# EAGLE design display (EAGLE 9.2.0)
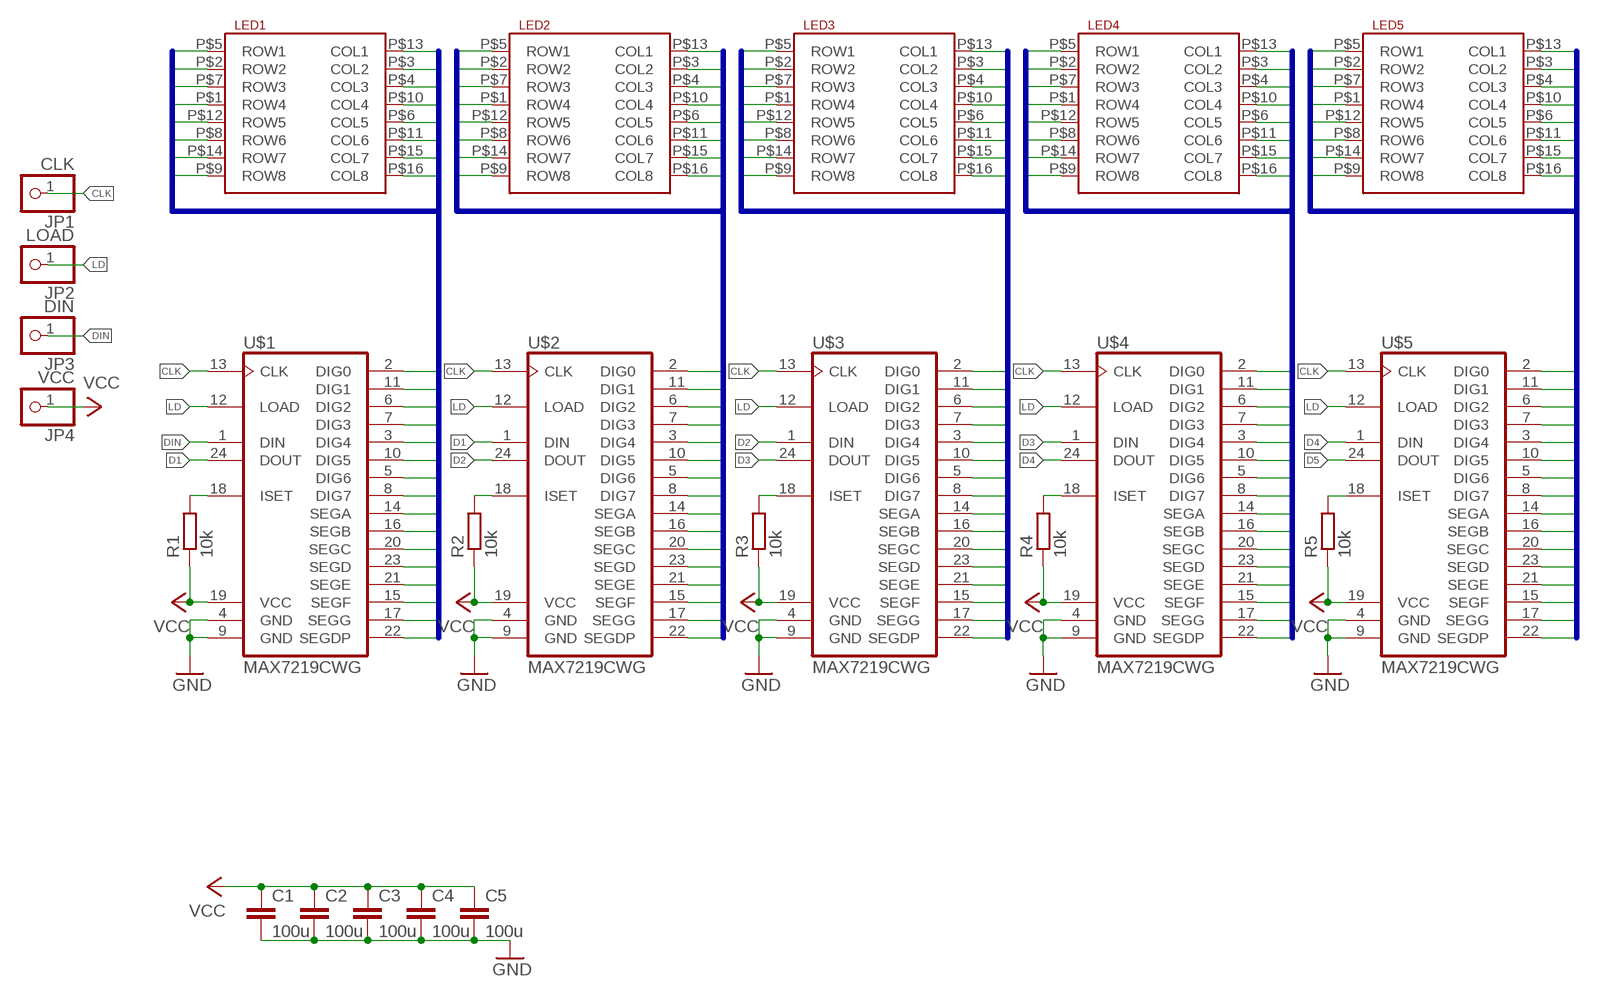
[diagram p0: schematic, sheet 1]

## Parts
C1  100u  C-EUC0805  [C0805]
C2  100u  C-EUC0805  [C0805]
C3  100u  C-EUC0805  [C0805]
C4  100u  C-EUC0805  [C0805]
C5  100u  C-EUC0805  [C0805]
JP1  CLK  PINHD-1X1  [1X01]
JP2  LOAD  PINHD-1X1  [1X01]
JP3  DIN  PINHD-1X1  [1X01]
JP4  VCC  PINHD-1X1  [1X01]
LED1  LED_8X8_MATRIX07088BH  [MATRIX_8X8_20MM]
LED2  LED_8X8_MATRIX07088BH  [MATRIX_8X8_20MM]
LED3  LED_8X8_MATRIX07088BH  [MATRIX_8X8_20MM]
LED4  LED_8X8_MATRIX07088BH  [MATRIX_8X8_20MM]
LED5  LED_8X8_MATRIX07088BH  [MATRIX_8X8_20MM]
R1  10k  R-EU_R0805  [R0805]
R2  10k  R-EU_R0805  [R0805]
R3  10k  R-EU_R0805  [R0805]
R4  10k  R-EU_R0805  [R0805]
R5  10k  R-EU_R0805  [R0805]
U$1  MAX7219CWG  [SO24L]
U$2  MAX7219CWG  [SO24L]
U$3  MAX7219CWG  [SO24L]
U$4  MAX7219CWG  [SO24L]
U$5  MAX7219CWG  [SO24L]

## Nets
CLK: JP1.1 U$1.13(CLK) U$2.13(CLK) U$3.13(CLK) U$4.13(CLK) U$5.13(CLK)
D1: U$1.24(DOUT) U$2.1(DIN)
D2: U$2.24(DOUT) U$3.1(DIN)
D3: U$3.24(DOUT) U$4.1(DIN)
D4: U$4.24(DOUT) U$5.1(DIN)
D5: U$5.24(DOUT)
DIN: JP3.1 U$1.1(DIN)
GND [GND]: C1.2 C2.2 C3.2 C4.2 C5.2 U$1.4(GND) U$1.9(GND) U$2.4(GND) U$2.9(GND) U$3.4(GND) U$3.9(GND) U$4.4(GND) U$4.9(GND) U$5.4(GND) U$5.9(GND)
LD: JP2.1 U$1.12(LOAD) U$2.12(LOAD) U$3.12(LOAD) U$4.12(LOAD) U$5.12(LOAD)
MATRIX1_ANODE1: LED1.P$5(ROW1) U$1.14(SEGA)
MATRIX1_ANODE2: LED1.P$2(ROW2) U$1.16(SEGB)
MATRIX1_ANODE3: LED1.P$7(ROW3) U$1.20(SEGC)
MATRIX1_ANODE4: LED1.P$1(ROW4) U$1.23(SEGD)
MATRIX1_ANODE5: LED1.P$12(ROW5) U$1.21(SEGE)
MATRIX1_ANODE6: LED1.P$8(ROW6) U$1.15(SEGF)
MATRIX1_ANODE7: LED1.P$14(ROW7) U$1.17(SEGG)
MATRIX1_ANODE8: LED1.P$9(ROW8) U$1.22(SEGDP)
MATRIX1_CATHODE1: LED1.P$13(COL1) U$1.2(DIG0)
MATRIX1_CATHODE2: LED1.P$3(COL2) U$1.11(DIG1)
MATRIX1_CATHODE3: LED1.P$4(COL3) U$1.6(DIG2)
MATRIX1_CATHODE4: LED1.P$10(COL4) U$1.7(DIG3)
MATRIX1_CATHODE5: LED1.P$6(COL5) U$1.3(DIG4)
MATRIX1_CATHODE6: LED1.P$11(COL6) U$1.10(DIG5)
MATRIX1_CATHODE7: LED1.P$15(COL7) U$1.5(DIG6)
MATRIX1_CATHODE8: LED1.P$16(COL8) U$1.8(DIG7)
MATRIX2_ANODE1: LED2.P$5(ROW1) U$2.14(SEGA)
MATRIX2_ANODE2: LED2.P$2(ROW2) U$2.16(SEGB)
MATRIX2_ANODE3: LED2.P$7(ROW3) U$2.20(SEGC)
MATRIX2_ANODE4: LED2.P$1(ROW4) U$2.23(SEGD)
MATRIX2_ANODE5: LED2.P$12(ROW5) U$2.21(SEGE)
MATRIX2_ANODE6: LED2.P$8(ROW6) U$2.15(SEGF)
MATRIX2_ANODE7: LED2.P$14(ROW7) U$2.17(SEGG)
MATRIX2_ANODE8: LED2.P$9(ROW8) U$2.22(SEGDP)
MATRIX2_CATHODE1: LED2.P$13(COL1) U$2.2(DIG0)
MATRIX2_CATHODE2: LED2.P$3(COL2) U$2.11(DIG1)
MATRIX2_CATHODE3: LED2.P$4(COL3) U$2.6(DIG2)
MATRIX2_CATHODE4: LED2.P$10(COL4) U$2.7(DIG3)
MATRIX2_CATHODE5: LED2.P$6(COL5) U$2.3(DIG4)
MATRIX2_CATHODE6: LED2.P$11(COL6) U$2.10(DIG5)
MATRIX2_CATHODE7: LED2.P$15(COL7) U$2.5(DIG6)
MATRIX2_CATHODE8: LED2.P$16(COL8) U$2.8(DIG7)
MATRIX3_ANODE1: LED3.P$5(ROW1) U$3.14(SEGA)
MATRIX3_ANODE2: LED3.P$2(ROW2) U$3.16(SEGB)
MATRIX3_ANODE3: LED3.P$7(ROW3) U$3.20(SEGC)
MATRIX3_ANODE4: LED3.P$1(ROW4) U$3.23(SEGD)
MATRIX3_ANODE5: LED3.P$12(ROW5) U$3.21(SEGE)
MATRIX3_ANODE6: LED3.P$8(ROW6) U$3.15(SEGF)
MATRIX3_ANODE7: LED3.P$14(ROW7) U$3.17(SEGG)
MATRIX3_ANODE8: LED3.P$9(ROW8) U$3.22(SEGDP)
MATRIX3_CATHODE1: LED3.P$13(COL1) U$3.2(DIG0)
MATRIX3_CATHODE2: LED3.P$3(COL2) U$3.11(DIG1)
MATRIX3_CATHODE3: LED3.P$4(COL3) U$3.6(DIG2)
MATRIX3_CATHODE4: LED3.P$10(COL4) U$3.7(DIG3)
MATRIX3_CATHODE5: LED3.P$6(COL5) U$3.3(DIG4)
MATRIX3_CATHODE6: LED3.P$11(COL6) U$3.10(DIG5)
MATRIX3_CATHODE7: LED3.P$15(COL7) U$3.5(DIG6)
MATRIX3_CATHODE8: LED3.P$16(COL8) U$3.8(DIG7)
MATRIX4_ANODE1: LED4.P$5(ROW1) U$4.14(SEGA)
MATRIX4_ANODE2: LED4.P$2(ROW2) U$4.16(SEGB)
MATRIX4_ANODE3: LED4.P$7(ROW3) U$4.20(SEGC)
MATRIX4_ANODE4: LED4.P$1(ROW4) U$4.23(SEGD)
MATRIX4_ANODE5: LED4.P$12(ROW5) U$4.21(SEGE)
MATRIX4_ANODE6: LED4.P$8(ROW6) U$4.15(SEGF)
MATRIX4_ANODE7: LED4.P$14(ROW7) U$4.17(SEGG)
MATRIX4_ANODE8: LED4.P$9(ROW8) U$4.22(SEGDP)
MATRIX4_CATHODE1: LED4.P$13(COL1) U$4.2(DIG0)
MATRIX4_CATHODE2: LED4.P$3(COL2) U$4.11(DIG1)
MATRIX4_CATHODE3: LED4.P$4(COL3) U$4.6(DIG2)
MATRIX4_CATHODE4: LED4.P$10(COL4) U$4.7(DIG3)
MATRIX4_CATHODE5: LED4.P$6(COL5) U$4.3(DIG4)
MATRIX4_CATHODE6: LED4.P$11(COL6) U$4.10(DIG5)
MATRIX4_CATHODE7: LED4.P$15(COL7) U$4.5(DIG6)
MATRIX4_CATHODE8: LED4.P$16(COL8) U$4.8(DIG7)
MATRIX5_ANODE1: LED5.P$5(ROW1) U$5.14(SEGA)
MATRIX5_ANODE2: LED5.P$2(ROW2) U$5.16(SEGB)
MATRIX5_ANODE3: LED5.P$7(ROW3) U$5.20(SEGC)
MATRIX5_ANODE4: LED5.P$1(ROW4) U$5.23(SEGD)
MATRIX5_ANODE5: LED5.P$12(ROW5) U$5.21(SEGE)
MATRIX5_ANODE6: LED5.P$8(ROW6) U$5.15(SEGF)
MATRIX5_ANODE7: LED5.P$14(ROW7) U$5.17(SEGG)
MATRIX5_ANODE8: LED5.P$9(ROW8) U$5.22(SEGDP)
MATRIX5_CATHODE1: LED5.P$13(COL1) U$5.2(DIG0)
MATRIX5_CATHODE2: LED5.P$3(COL2) U$5.11(DIG1)
MATRIX5_CATHODE3: LED5.P$4(COL3) U$5.6(DIG2)
MATRIX5_CATHODE4: LED5.P$10(COL4) U$5.7(DIG3)
MATRIX5_CATHODE5: LED5.P$6(COL5) U$5.3(DIG4)
MATRIX5_CATHODE6: LED5.P$11(COL6) U$5.10(DIG5)
MATRIX5_CATHODE7: LED5.P$15(COL7) U$5.5(DIG6)
MATRIX5_CATHODE8: LED5.P$16(COL8) U$5.8(DIG7)
N$1: R5.2 U$5.18(ISET)
N$5: R1.2 U$1.18(ISET)
N$10: R2.2 U$2.18(ISET)
N$15: R3.2 U$3.18(ISET)
N$20: R4.2 U$4.18(ISET)
VCC [VCC]: C1.1 C2.1 C3.1 C4.1 C5.1 JP4.1 R1.1 R2.1 R3.1 R4.1 R5.1 U$1.19(VCC) U$2.19(VCC) U$3.19(VCC) U$4.19(VCC) U$5.19(VCC)

## Buses
MATRIX1:MATRIX1_ANODE1,MATRIX1_ANODE2,MATRIX1_ANODE3,MATRIX1_ANODE4,MATRIX1_ANODE5,MATRIX1_ANODE6,MATRIX1_ANODE7,MATRIX1_ANODE8,MATRIX1_CATHODE1,MATRIX1_CATHODE2,MATRIX1_CATHODE3,MATRIX1_CATHODE4,MATRIX1_CATHODE5,MATRIX1_CATHODE6,MATRIX1_CATHODE7,MATRIX1_CATHODE8
MATRIX2:MATRIX2_ANODE1,MATRIX2_ANODE2,MATRIX2_ANODE3,MATRIX2_ANODE4,MATRIX2_ANODE5,MATRIX2_ANODE6,MATRIX2_ANODE7,MATRIX2_ANODE8,MATRIX2_CATHODE1,MATRIX2_CATHODE2,MATRIX2_CATHODE3,MATRIX2_CATHODE4,MATRIX2_CATHODE5,MATRIX2_CATHODE6,MATRIX2_CATHODE7,MATRIX2_CATHODE8
MATRIX3:MATRIX3_ANODE1,MATRIX3_ANODE2,MATRIX3_ANODE3,MATRIX3_ANODE4,MATRIX3_ANODE5,MATRIX3_ANODE6,MATRIX3_ANODE7,MATRIX3_ANODE8,MATRIX3_CATHODE1,MATRIX3_CATHODE2,MATRIX3_CATHODE3,MATRIX3_CATHODE4,MATRIX3_CATHODE5,MATRIX3_CATHODE6,MATRIX3_CATHODE7,MATRIX3_CATHODE8
MATRIX4:MATRIX4_ANODE1,MATRIX4_ANODE2,MATRIX4_ANODE3,MATRIX4_ANODE4,MATRIX4_ANODE5,MATRIX4_ANODE6,MATRIX4_ANODE7,MATRIX4_ANODE8,MATRIX4_CATHODE1,MATRIX4_CATHODE2,MATRIX4_CATHODE3,MATRIX4_CATHODE4,MATRIX4_CATHODE5,MATRIX4_CATHODE6,MATRIX4_CATHODE7,MATRIX4_CATHODE8
MATRIX5:MATRIX5_ANODE1,MATRIX5_ANODE2,MATRIX5_ANODE3,MATRIX5_ANODE4,MATRIX5_ANODE5,MATRIX5_ANODE6,MATRIX5_ANODE7,MATRIX5_ANODE8,MATRIX5_CATHODE1,MATRIX5_CATHODE2,MATRIX5_CATHODE3,MATRIX5_CATHODE4,MATRIX5_CATHODE5,MATRIX5_CATHODE6,MATRIX5_CATHODE7,MATRIX5_CATHODE8

## Library data of the parts
C1-C5 = rcl:C-EU: CAPACITOR, European symbol; SPICEPREFIX: C
JP1-JP4 = pinhead:PINHD-1X1: PIN HEADER
LED1-LED5 = LED:LED_8X8_MATRIX: CPD-15088A YGD2/A Green 8x8 LED matrix
R1-R5 = rcl:R-EU_: RESISTOR, European symbol; SPICEPREFIX: R
U$1-U$5 = max7219:MAX7219CWG

## Net classes
0 default: width 0.3 mm
1 VCC: width 0.5 mm
2 GND: width 0.5 mm

## Board
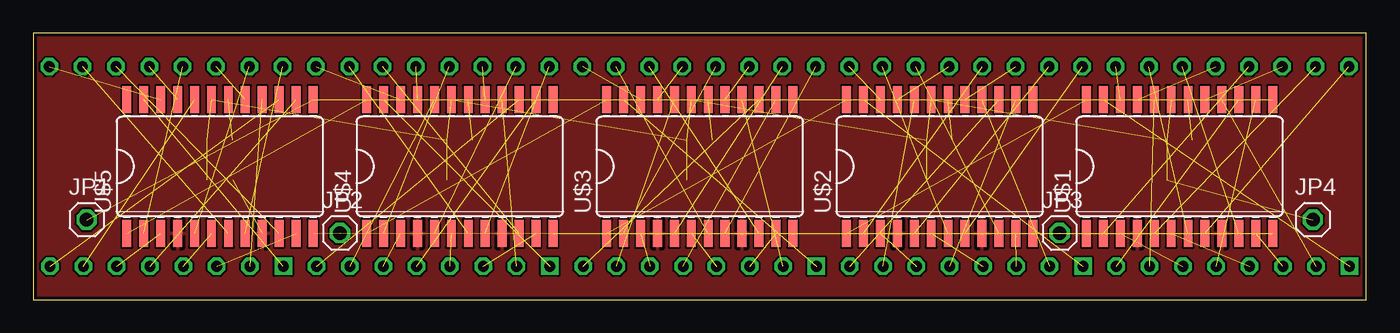
[diagram p1: board, top side]
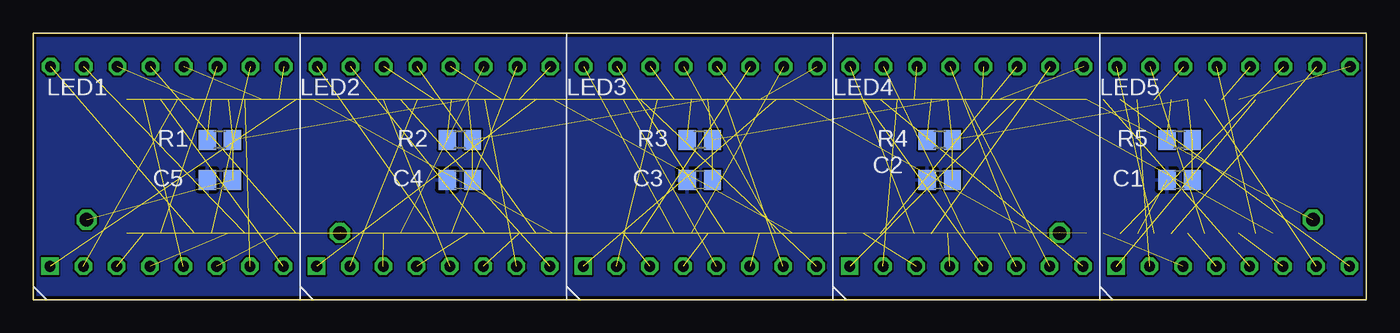
[diagram p2: board, bottom side, seen from below]

Size 100 x 20 mm. Coordinates in mm from the lower left corner, seen from the top.
Outline: 0,0 100,0 100,20 0,20 0,0
Copper layers (1*16): Top 0.035mm / dielectric 1.5mm / Bottom 0.035mm
Design rules "SeeedStudio_2layer_DRU_no_angle_20140221 *": minimum track width 6mil, minimum drill 12mil, track to track 6mil, track to pad 6mil, pad to pad 6mil, via to via 6mil, smd to smd 0mil, copper to edge 10mil, drill to drill 10mil, minimum pad ring 10mil, minimum via ring 6mil, stop-mask expansion 2mil, vias tented up to drill 100mil, thermal gap 10mil

### Footprints (pad centres in the part's own frame; a part is rotated, then mirrored left to right if it is on the bottom)
C0805 = smd 1.3 x 1.5: 1 -0.95,0; 2 0.95,0
1X01 = drill 1.016 octagon: 1 0,0
MATRIX_8X8_20MM = drill 0.8 square: P$1 1.25,2.5 | drill 0.8 octagon: P$2 3.75,2.5; P$3 6.25,2.5; P$4 8.75,2.5; P$5 11.25,2.5; P$6 13.75,2.5; P$7 16.25,2.5; P$8 18.75,2.5; P$9 18.8,17.5; P$10 16.3,17.5; P$11 13.8,17.5; P$12 11.3,17.5; P$13 8.8,17.5; P$14 6.3,17.5; P$15 3.8,17.5; P$16 1.3,17.5
R0805 = smd 1.3 x 1.5: 1 -0.95,0; 2 0.95,0
SO24L = smd 0.66 x 2.032: 1 -6.985,-5.029; 2 -5.715,-5.029; 3 -4.445,-5.029; 4 -3.175,-5.029; 5 -1.905,-5.029; 6 -0.635,-5.029; 7 0.635,-5.029; 8 1.905,-5.029; 9 3.175,-5.029; 10 4.445,-5.029; 11 5.715,-5.029; 12 6.985,-5.029; 13 6.985,5.029; 14 5.715,5.029; 15 4.445,5.029; 16 3.175,5.029; 17 1.905,5.029; 18 0.635,5.029; 19 -0.635,5.029; 20 -1.905,5.029; 21 -3.175,5.029; 22 -4.445,5.029; 23 -5.715,5.029; 24 -6.985,5.029

### Placement (x,y rotation side)
C1  14,9 180 bottom
C2  32,9 180 bottom
C3  50,9 180 bottom
C4  68,9 180 bottom
C5  86,9 180 bottom
JP1  4,6 0 top
JP2  23,5 0 top
JP3  77,5 0 top
JP4  96,6 0 top
LED1  100,0 0 bottom
LED2  80,0 0 bottom
LED3  60,0 0 bottom
LED4  40,0 0 bottom
LED5  20,0 0 bottom
R1  86,12 180 bottom
R2  68,12 180 bottom
R3  50,12 180 bottom
R4  32,12 180 bottom
R5  14,12 180 bottom
U$1  86,10 0 top
U$2  68,10 0 top
U$3  50,10 0 top
U$4  32,10 0 top
U$5  14,10 0 top

### Tracks (layer width: path | path; a pad name or v marks a point on that pad's centre or on a via)
CLK  (5 unrouted)
D1  (1 unrouted)
D2  (1 unrouted)
D3  (1 unrouted)
D4  (1 unrouted)
DIN  (1 unrouted)
GND  (1 unrouted)
  pour Bottom: 0,0 100,0 100,20 0,20
  pour Top: 0,0 100,0 100,20 0,20
LD  (5 unrouted)
MATRIX1_ANODE1  (1 unrouted)
MATRIX1_ANODE2  (1 unrouted)
MATRIX1_ANODE3  (1 unrouted)
MATRIX1_ANODE4  (1 unrouted)
MATRIX1_ANODE5  (1 unrouted)
MATRIX1_ANODE6  (1 unrouted)
MATRIX1_ANODE7  (1 unrouted)
MATRIX1_ANODE8  (1 unrouted)
MATRIX1_CATHODE1  (1 unrouted)
MATRIX1_CATHODE2  (1 unrouted)
MATRIX1_CATHODE3  (1 unrouted)
MATRIX1_CATHODE4  (1 unrouted)
MATRIX1_CATHODE5  (1 unrouted)
MATRIX1_CATHODE6  (1 unrouted)
MATRIX1_CATHODE7  (1 unrouted)
MATRIX1_CATHODE8  (1 unrouted)
MATRIX2_ANODE1  (1 unrouted)
MATRIX2_ANODE2  (1 unrouted)
MATRIX2_ANODE3  (1 unrouted)
MATRIX2_ANODE4  (1 unrouted)
MATRIX2_ANODE5  (1 unrouted)
MATRIX2_ANODE6  (1 unrouted)
MATRIX2_ANODE7  (1 unrouted)
MATRIX2_ANODE8  (1 unrouted)
MATRIX2_CATHODE1  (1 unrouted)
MATRIX2_CATHODE2  (1 unrouted)
MATRIX2_CATHODE3  (1 unrouted)
MATRIX2_CATHODE4  (1 unrouted)
MATRIX2_CATHODE5  (1 unrouted)
MATRIX2_CATHODE6  (1 unrouted)
MATRIX2_CATHODE7  (1 unrouted)
MATRIX2_CATHODE8  (1 unrouted)
MATRIX3_ANODE1  (1 unrouted)
MATRIX3_ANODE2  (1 unrouted)
MATRIX3_ANODE3  (1 unrouted)
MATRIX3_ANODE4  (1 unrouted)
MATRIX3_ANODE5  (1 unrouted)
MATRIX3_ANODE6  (1 unrouted)
MATRIX3_ANODE7  (1 unrouted)
MATRIX3_ANODE8  (1 unrouted)
MATRIX3_CATHODE1  (1 unrouted)
MATRIX3_CATHODE2  (1 unrouted)
MATRIX3_CATHODE3  (1 unrouted)
MATRIX3_CATHODE4  (1 unrouted)
MATRIX3_CATHODE5  (1 unrouted)
MATRIX3_CATHODE6  (1 unrouted)
MATRIX3_CATHODE7  (1 unrouted)
MATRIX3_CATHODE8  (1 unrouted)
MATRIX4_ANODE1  (1 unrouted)
MATRIX4_ANODE2  (1 unrouted)
MATRIX4_ANODE3  (1 unrouted)
MATRIX4_ANODE4  (1 unrouted)
MATRIX4_ANODE5  (1 unrouted)
MATRIX4_ANODE6  (1 unrouted)
MATRIX4_ANODE7  (1 unrouted)
MATRIX4_ANODE8  (1 unrouted)
MATRIX4_CATHODE1  (1 unrouted)
MATRIX4_CATHODE2  (1 unrouted)
MATRIX4_CATHODE3  (1 unrouted)
MATRIX4_CATHODE4  (1 unrouted)
MATRIX4_CATHODE5  (1 unrouted)
MATRIX4_CATHODE6  (1 unrouted)
MATRIX4_CATHODE7  (1 unrouted)
MATRIX4_CATHODE8  (1 unrouted)
MATRIX5_ANODE1  (1 unrouted)
MATRIX5_ANODE2  (1 unrouted)
MATRIX5_ANODE3  (1 unrouted)
MATRIX5_ANODE4  (1 unrouted)
MATRIX5_ANODE5  (1 unrouted)
MATRIX5_ANODE6  (1 unrouted)
MATRIX5_ANODE7  (1 unrouted)
MATRIX5_ANODE8  (1 unrouted)
MATRIX5_CATHODE1  (1 unrouted)
MATRIX5_CATHODE2  (1 unrouted)
MATRIX5_CATHODE3  (1 unrouted)
MATRIX5_CATHODE4  (1 unrouted)
MATRIX5_CATHODE5  (1 unrouted)
MATRIX5_CATHODE6  (1 unrouted)
MATRIX5_CATHODE7  (1 unrouted)
MATRIX5_CATHODE8  (1 unrouted)
N$1  (1 unrouted)
N$5  (1 unrouted)
N$10  (1 unrouted)
N$15  (1 unrouted)
N$20  (1 unrouted)
VCC  (15 unrouted)